# EasyEDA Pro project debug_jig.eprj

# Schematic Schematic1
Board Name: Board1; Create Date: 2026-01-15; Page Name: P1; Project Name: debug_jig; Schematic Name: Schematic1; Update Date: 2026-01-31; Company: EasyEDA.com; Page Size: A4; Version: V1.0
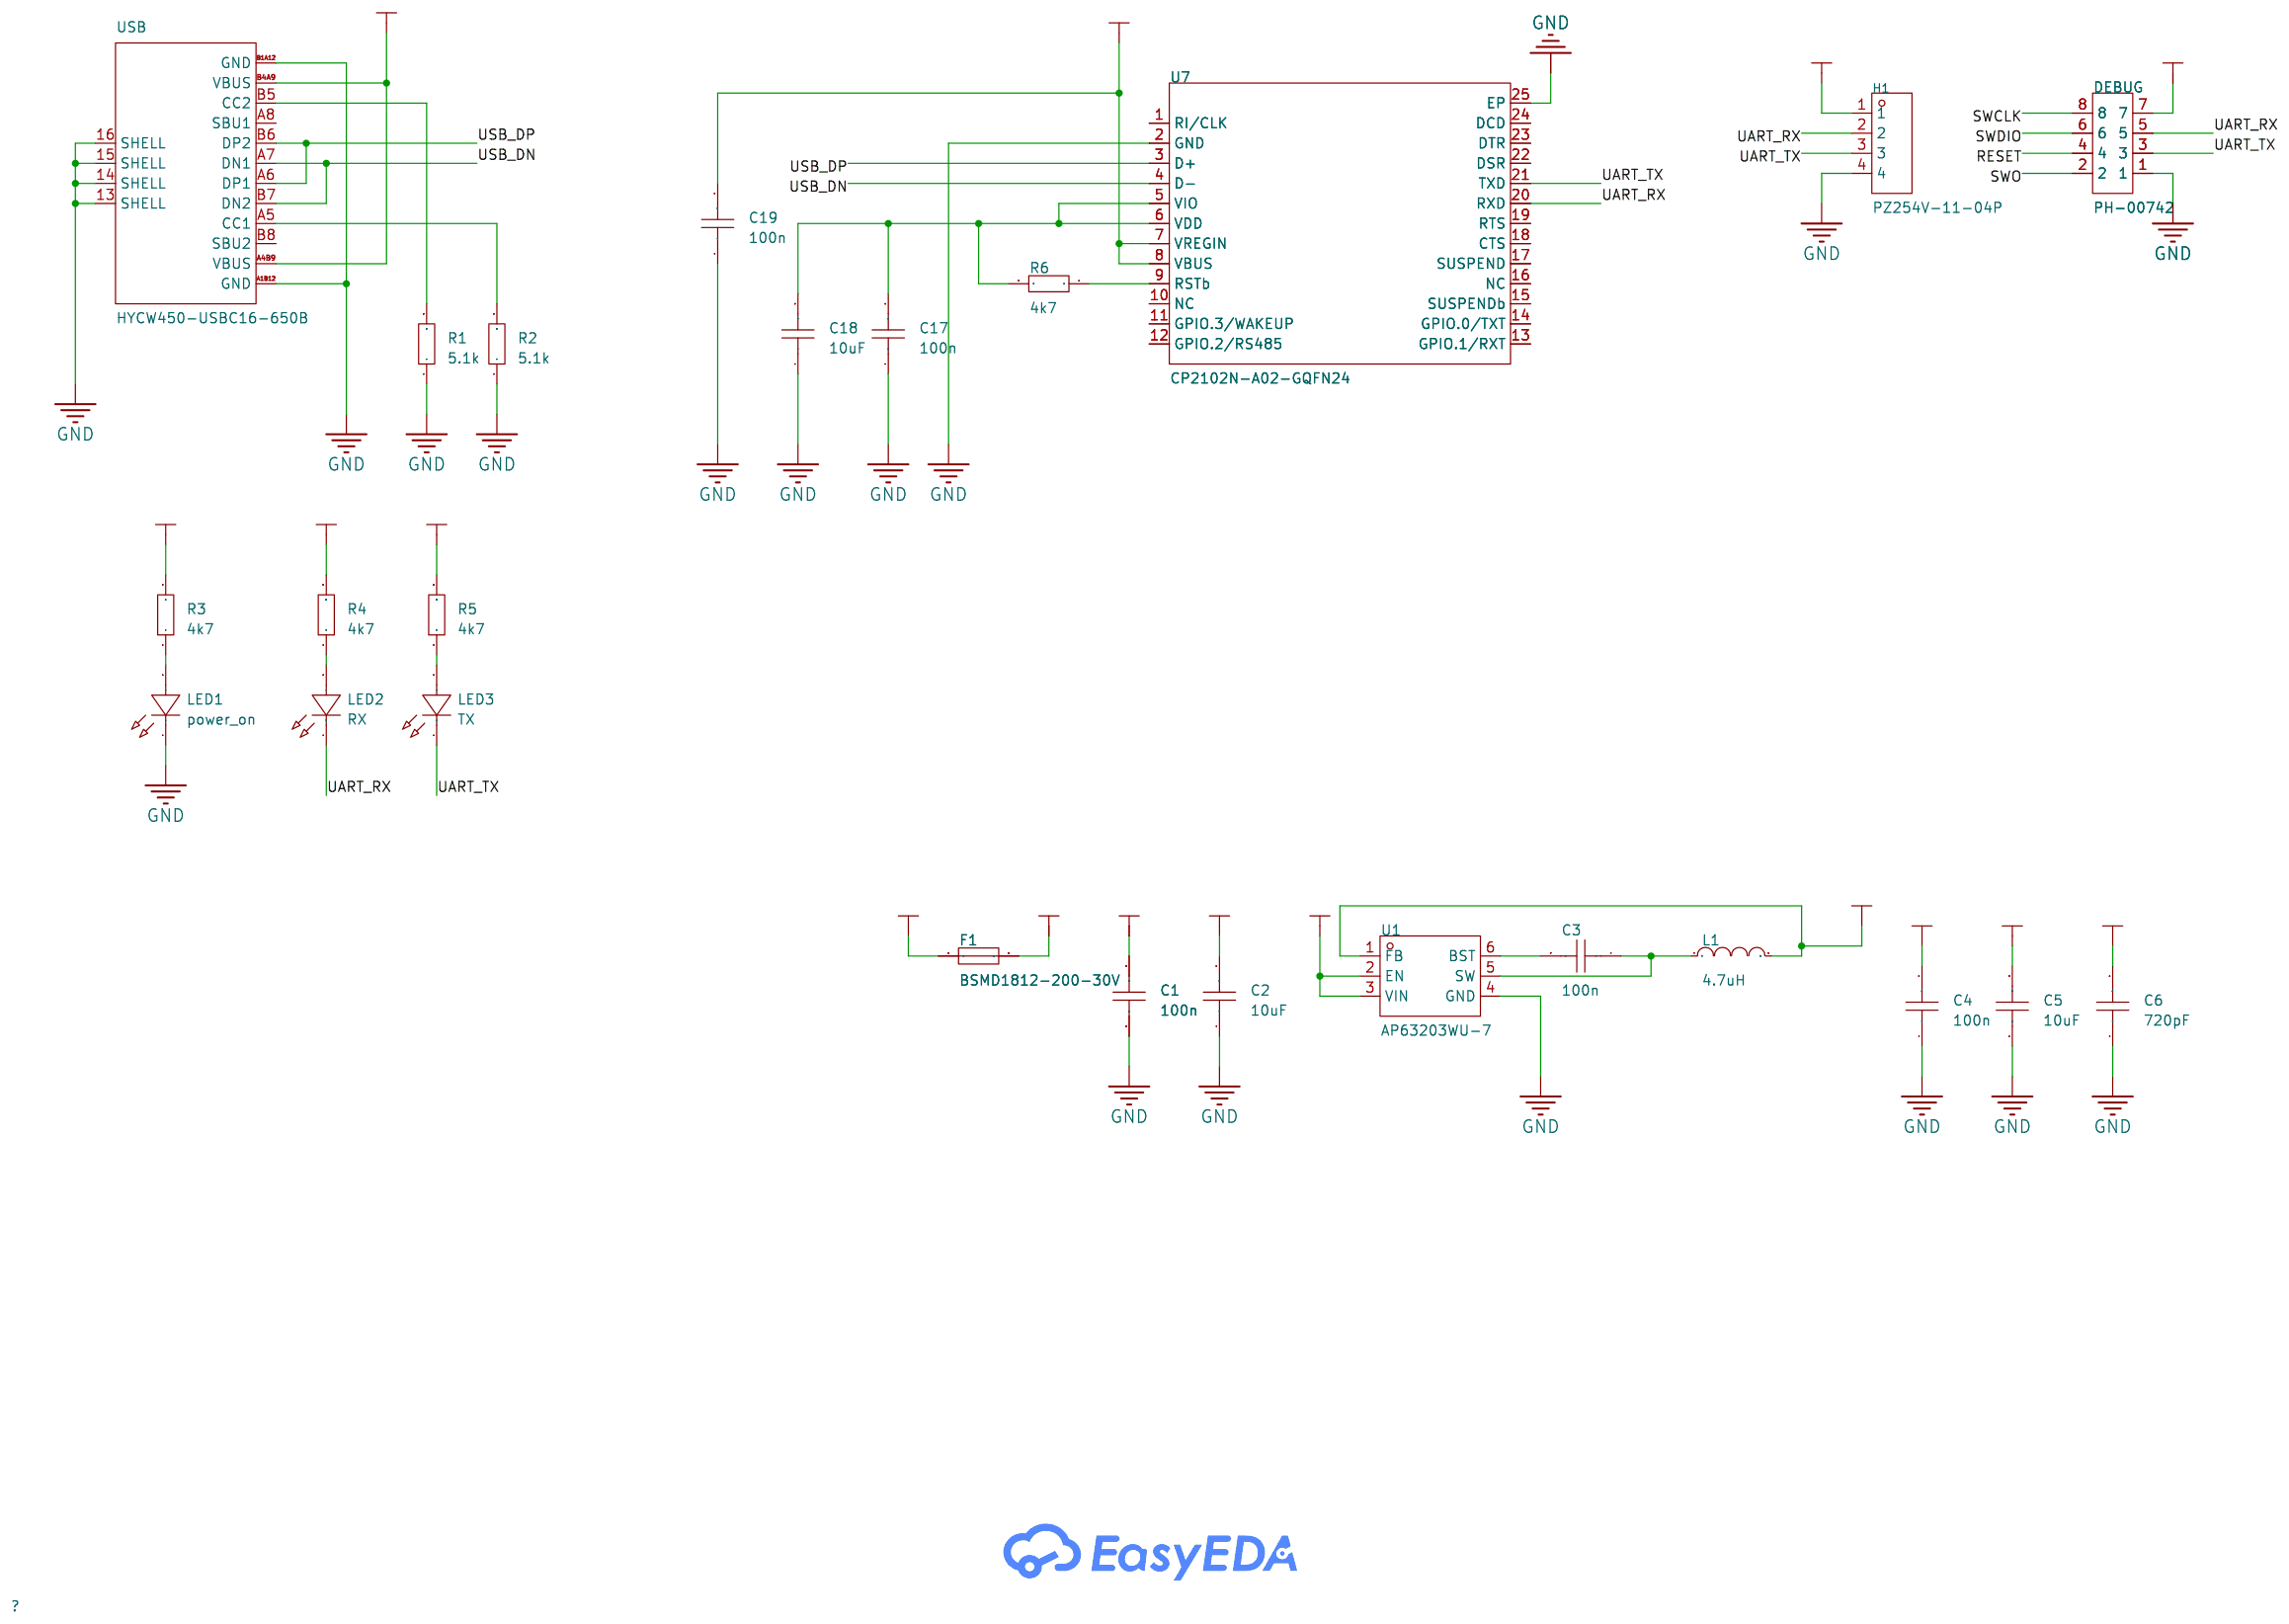
[diagram p0: schematic sheet]

## Parts
C1  100n  [C0805]
C2  100n  [C0805]
C3  100n  [C0805]
C4  100n  [C0805]
C5  100n  [C0805]
C6  100n  [C0805]
C17  100n  [C0805]
C18  100n  [C0805]
C19  100n  [C0805]
DEBUG  PH-00742  [HDR-TH_8P-P1.27-V-M-R2-C4-S1.27]
F1  BSMD1812-200-30V  [F1812]
H1  PZ254V-11-04P  [HDR-TH_4P-P2.54-V-M]
L1  4.7uH  [IND-SMD_L4.0-W4.0_FNR40XXS]
LED1  power_on  [LED1206-RD]
LED2  RX  [LED1206-RD]
LED3  TX  [LED1206-RD]
R1  330  [R0805]
R2  330  [R0805]
R3  4k7  [R0805]
R4  4k7  [R0805]
R5  4k7  [R0805]
R6  4k7  [R0805]
U1  AP63203WU-7  [TSOT-26_L2.9-W1.6-P0.95-LS2.8-BL]
U7  CP2102N-A02-GQFN24  [QFN-24_L4.0-W4.0-P0.50-TL-EP2.5]
USB  HYCW450-USBC16-650B  [USB-C-SMD_HYCW450-USBC16-650B]

## Library data of the parts
C1-C6 C17-C19 = CL21A106KAYNNNE_C15850: Capacitance:10uF Tolerance:±10% Tolerance:±10% Voltage Rating:25V Temperature Coefficient:X5R; LCSC Part Name: 10uF ±10% 25V; Supplier Part: C15850; Manufacturer: SAMSUNG(三星); Manufacturer Part: CL21A106KAYNNNE; Supplier Footprint: 0805; JLCPCB Part Class: Basic Part; Datasheet: https://item.szlcsc.com/datasheet/CL21A106KAYNNNE/16532.html; Supplier: LCSC; Tolerance: ±10%; Voltage Rating: 25V; Temperature Coefficient: X5R
DEBUG = PH-00742: Pin Structure:2x4P Pitch:1.27mm Row Spacing:1.27mm Circluar Pins/Square Pins:Pin Header Mounting Type:Through Hole Number of Rows:2 Number of Pins:8P Current Rating:1A Voltage Rating (Max):- Length of Mating Pin:3mm Insulation Height:2mm Length of End Con; LCSC Part Name: 2x4P 间距:1.27mm 方针 直插; Supplier Part: C2685182; Manufacturer: Liansheng(连盛); Supplier Footprint: 插件,P=1.27mm; JLCPCB Part Class: Extended Part; Datasheet: https://item.szlcsc.com/datasheet/PH-00742/2784456.html; Supplier: LCSC; Pin Structure: 2x4P; Pitch: 1.27mm; Row Spacing: 1.27mm; Circluar Pins/Square Pins: Pin Header; Mounting Type: Through Hole; Number of Rows: 2; Number of Pins: 8P; Current Rating: 1A; Length of Mating Pin: 3mm; Insulation Height: 2mm; Length of End Connection Pin: 2mm; Operating Temperature: -40℃~+105℃; Color: Black
F1 = BSMD1812-200-30V: Voltage - Max:30V Current - Max:40A Hold Current:2A Trip Current:4A Power Dissipation:1W Resistance - Initial (Ri) (Min):20mΩ Resistance - Post Trip (R1) (Max):100mΩ Time to Trip(Max):- Operating Temperature:-40℃~+85℃ Operating Temperature:-40℃~+85℃ Lengt; LCSC Part Name: 30V 2A 1812自恢复; Supplier Part: C960026; Manufacturer: BHFUSE(佰宏); Supplier Footprint: 1812; JLCPCB Part Class: Extended Part; Datasheet: https://item.szlcsc.com/datasheet/BSMD1812-200-30V/1039126.html; Supplier: LCSC; Voltage - Max: 30V; Current - Max: 40A; Hold Current: 2A; Trip Current: 4A; Power Dissipation: 1W; Resistance - Initial (Ri) (Min): 20mΩ; Resistance - Post Trip (R1) (Max): 100mΩ; Operating Temperature: -40℃~+85℃; Length: 4.73mm; Width: 3.41mm; Height: 1.5mm
H1 = PZ254V-11-04P: LCSC Part Name: 1x4P 间距:2.54mm 方针 直插; Supplier Part: C2691448; Manufacturer: XFCN(兴飞); Supplier Footprint: 插件,P=2.54mm; JLCPCB Part Class: Extended Part; Datasheet: https://item.szlcsc.com/datasheet/PZ254V-11-04P/2801085.html; Supplier: LCSC; Pin Structure: 1x4P; Pitch: 2.54mm; Circluar Pins/Square Pins: Pin Header; Mounting Type: Through Hole; Number of Rows: 1; Number of Pins: 4P; Current Rating: 3A; Voltage Rating (Max): 250V; Length of Mating Pin: 6mm; Insulation Height: 2.5mm; Length of End Connection Pin: 3mm; Operating Temperature: -40℃~+105℃; Color: Black
L1 = FNR4030S4R7MT: Inductance:4.7uH Tolerance:±20% Tolerance:±20% Current Rating:2.3A Current - Saturation(Isat):3.2A DC Resistance(DCR):78mΩ Type:Magnetic Core Shielded Winding Alloy Inductor; LCSC Part Name: 4.7uH ±20% 3.2A; Supplier Part: C167874; Manufacturer: cjiang(长江微电); Supplier Footprint: SMD,4x4mm; JLCPCB Part Class: Extended Part; Datasheet: https://atta.szlcsc.com/upload/public/pdf/source/20190327/C167925_9EFF0AABC4CA629C2CC95961DBF7D39D.pdf; Supplier: LCSC; Tolerance: ±20%; Current Rating: 2.3A; Current - Saturation(Isat): 3.2A; DC Resistance(DCR): 78mΩ; Type: Magnetic Core Shielded Winding Alloy Inductor
LED1-LED3 = YLED1206G: Lamp Holder Type:- Illumination Color:Emerald Green Voltage - Forward(Vf):2.4V~3.1V Voltage - Forward(Vf):2.4V~3.1V Power(Watts):100mW Forward Current:20mA Wavelength - Dominant:516nm~531nm Wavelength - Dominant:516nm~531nm Peak Wavelength:525nm Diode Con; LCSC Part Name: 发光管; Supplier Part: C30584801; Manufacturer: YONGYUTAI(永裕泰); Supplier Footprint: 1206; JLCPCB Part Class: Extended Part; Datasheet: https://item.szlcsc.com/datasheet/YLED1206G/32319013.html; Supplier: LCSC; Illumination Color: Emerald Green; Voltage - Forward(Vf): 2.4V~3.1V; Power(Watts): 100mW; Forward Current: 20mA; Wavelength - Dominant: 516nm~531nm; Peak Wavelength: 525nm; Luminous Intensity: 620mcd; Viewing Angle: 120°; Operating Temperature: -40℃~+85℃
R1-R6 = 0805W8F1002T5E: Type:Thick Film Resistor Resistance:10kΩ Tolerance:±1% Tolerance:±1% Power(Watts):125mW Voltage-Supply(Max):150V Temperature Coefficient:±100ppm/℃ Temperature Coefficient:±100ppm/℃ Operating Temperature:-55℃~+155℃ Operating Temperature:-55℃~+155℃; LCSC Part Name: 10kΩ ±1% 125mW 厚膜电阻; Supplier Part: C17414; Manufacturer: UNI-ROYAL(厚声); Supplier Footprint: 0805; JLCPCB Part Class: Basic Part; Datasheet: https://item.szlcsc.com/datasheet/0805W8F1002T5E/18102.html; Supplier: LCSC; Type: Thick Film Resistor; Tolerance: ±1%; Power(Watts): 125mW; Voltage-Supply(Max): 150V; Temperature Coefficient: ±100ppm/℃; Operating Temperature: -55℃~+155℃
U1 = AP63203WU-7: Function:Buck Voltage - Supply:3.8V~32V Voltage - Supply:3.8V~32V Output Voltage:3.3V Output Voltage:3.3V Output Current:2A Frequency - Switching:1.1MHz Frequency - Switching:1.1MHz Operating Temperature:-40℃~+85℃@(TA) Operating Temperature:-40℃~+85℃@(TA); LCSC Part Name: 3.8V至32V输入、2A低静态电流同步降压转换器，增强EMI抑制; Supplier Part: C780769; Manufacturer: DIODES(美台); Supplier Footprint: TSOT-23-6; JLCPCB Part Class: Extended Part; Datasheet: https://item.szlcsc.com/datasheet/AP63203WU-7/832852.html; Supplier: LCSC; Function: Buck; Voltage - Supply: 3.8V~32V; Output Voltage: 3.3V; Output Current: 2A; Frequency - Switching: 1.1MHz; Operating Temperature: -40℃~+85℃@(TA); Synchronous Rectifier: Yes; Number of Outputs: 1; Topology: Buck; Quiescent Current: 22uA; Switch tube (built-in/external): Built-In; Output Type: Fixed
U7 = CP2102N-A02-GQFN24: Supplier Part: C1550551; Manufacturer: SKYWORKS/SILICON LABS(芯科); Supplier Footprint: QFN-24-EP(4x4); JLCPCB Part Class: Extended Part; Datasheet: https://atta.szlcsc.com/upload/public/pdf/source/20201204/C964632_F2B790CC23A72455AEF523510305B30A.pdf; Supplier: LCSC; Applications Function: USB to UART; Voltage - Supply: 3V~3.6V; Operating Temperature: -40℃~+85℃@(Ta)
USB = HYCW450-USBC16-650B: Connector Type:Type-C Protocol Standard:- Gender:Female Mounting Type:Surface Mount, Right Angle Number of Contacts:16P Number of Ports:1 Current Rating-Power:5A Voltage Rating:- Connect-Disconnect Life:10,000 Cycles Length:6.5mm Detection color:Black Ope; LCSC Part Name: Type-C 母 卧贴; Supplier Part: C42400253; Manufacturer: 华宇创; Supplier Footprint: SMD; Datasheet: https://item.szlcsc.com/datasheet/HYCW450-USBC16-650B/44352786.html; Supplier: LCSC; Connector Type: Type-C; Gender: Female; Mounting Type: Surface Mount, Right Angle; Number of Contacts: 16P; Number of Ports: 1; Current Rating-Power: 5A; Connect-Disconnect Life: 10,000 Cycles; Length: 6.5mm; Detection color: Black; Operating Temperature: -25℃~+85℃

## Nets
3V3: C4.2 C5.2 C6.2 DEBUG.7 H1.1 L1.2 R3.2 R4.2 R5.2 U1.1(FB)
5V: C1.2 C2.2 C19.2 F1.2 U1.2(EN) U1.3(VIN) U7.7(VREGIN) U7.8(VBUS)
GND: C1.1 C2.1 C4.1 C5.1 C6.1 C17.1 C18.1 C19.1 DEBUG.1 H1.4 LED1.1(K) R1.1 R2.1 U1.4(GND) U7.2(GND) U7.25(EP) USB.13(SHELL) USB.14(SHELL) USB.15(SHELL) USB.16(SHELL) USB.A1B12(GND) USB.B1A12(GND)
VDD: F1.1 USB.A4B9(VBUS) USB.B4A9(VBUS)
RESET: DEBUG.4
SWCLK: DEBUG.8
SWDIO: DEBUG.6
SWO: DEBUG.2
UART_RX: DEBUG.5 H1.2 LED2.1(K) U7.20(RXD)
UART_TX: DEBUG.3 H1.3 LED3.1(K) U7.21(TXD)
USB_DN: U7.4(D-) USB.A7(DN1) USB.B7(DN2)
USB_DP: U7.3(D+) USB.A6(DP1) USB.B6(DP2)
$1N4420: R1.2 USB.B5(CC2)
$1N4421: R2.2 USB.A5(CC1)
$1N4426: LED1.2(A) R3.1
$1N4451: C3.2 U1.6(BST)
$1N4452: C3.1 L1.1 U1.5(SW)
$1N4475: LED2.2(A) R4.1
$1N4479: LED3.2(A) R5.1
$1N6957: C17.2 C18.2 R6.2 U7.5(VIO) U7.6(VDD)
$1N7341: R6.1 U7.9(RSTb)

Not connected (* = marked no-connect by the designer): U7 1(RI/CLK) 10(NC) 11(GPIO.3/WAKEUP) 12(GPIO.2/RS485) 13(GPIO.1/RXT) 14(GPIO.0/TXT) 15(SUSPENDb) 16(NC) 17(SUSPEND) 18(CTS) 19(RTS) 22(DSR) 23(DTR) 24(DCD); USB A8(SBU1) B8(SBU2)

# Board PCB1
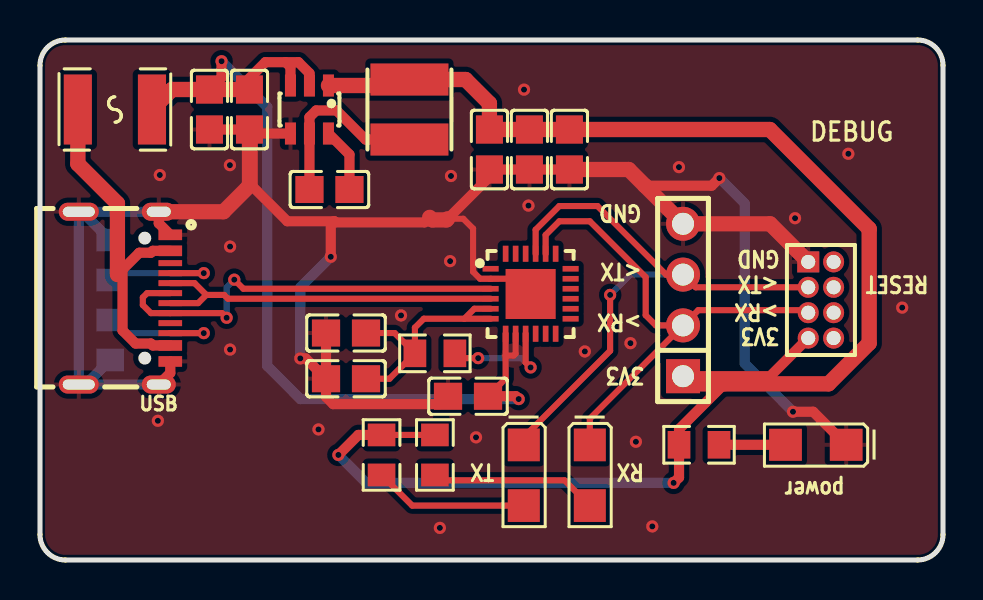
[diagram p1: board, top side]
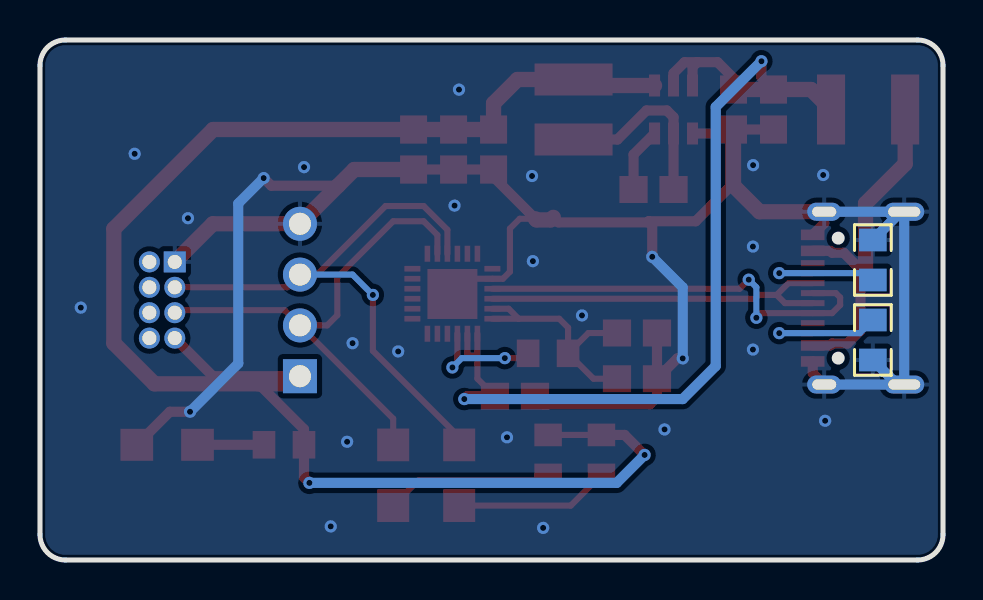
[diagram p2: board, bottom side, seen from below]

Outline 45.16 x 26 mm; copper layers: Top Layer, Bottom Layer. Coordinates in mm from the lower left corner of the outline.
Outline path: 0,24.73 0,1.27 arc(0.37,0.37) 1.27,0 43.89,0 arc(44.79,0.37) 45.16,1.27 45.16,24.73 arc(44.79,25.63) 43.89,26 1.27,26 arc(0.37,25.63) 0,24.73
Stack: Top Layer 0.035mm / Dielectric1 1.51mm FR4 er 4.5 / Bottom Layer 0.035mm

## Design rules (mm)
template: JLCPCB Capability(Two Layers Board)
spacing copperThickness1oz (default): track to track 0.102, other pairs 0.152 to 0.3
spacing copperThickness2oz: track to track 0.203, other pairs 0.152 to 0.3
track width copperThickness1oz (default): min 0.127, default 0.254, max 2.54
track width copperThickness2oz: min 0.203, default 0.254, max 2.54
differential pair differentialPair (default): width min 0.127, default 0.254, max 2.54; gap min 0.152, default 0.152
via viaSize (default): diameter min 0.5, default 0.61, max 10; hole min 0.3, default 0.305, max 6.3

## Placement (name value [footprint] x y rotation side)
C1  100n  [C0805]  10.48 22.52 90 top
C2  100n  [C0805]  8.48 22.52 90 top
C3  100n  [C0805]  14.48 18.52 0 top
C4  100n  [C0805]  22.48 20.52 90 top
C5  100n  [C0805]  24.48 20.52 90 top
C6  100n  [C0805]  26.48 20.52 90 top
C17  100n  [C0805]  15.3 11.35 0 top
C18  100n  [C0805]  15.3 9.06 0 top
C19  100n  [C0805]  21.4 8.19 0 top
DEBUG  PH-00742  [HDR-TH_8P-P1.27-V-M-R2-C4-S1.27]  39.05 13 270 top
F1  BSMD1812-200-30V  [F1812]  3.75 22.53 0 top
H1  PZ254V-11-04P  [HDR-TH_4P-P2.54-V-M]  32.16 13 90 top
L1  4.7uH  [IND-SMD_L4.0-W4.0_FNR40XXS]  18.48 22.52 90 top
LED1  power_on  [LED1206-RD]  38.8 5.76 180 top
LED2  RX  [LED1206-RD]  27.5 4.24 270 top
LED3  TX  [LED1206-RD]  24.19 4.24 270 top
R1  330  [R0805]  3.51 11 90 bottom
R2  330  [R0805]  3.51 15 270 bottom
R3  4k7  [R0805]  32.96 5.76 180 top
R4  4k7  [R0805]  19.75 5.25 90 top
R5  4k7  [R0805]  17.08 5.25 90 top
R6  4k7  [R0805]  19.75 10.33 180 top
U1  AP63203WU-7  [TSOT-26_L2.9-W1.6-P0.95-LS2.8-BL]  13.48 22.52 180 top
U7  CP2102N-A02-GQFN24  [QFN-24_L4.0-W4.0-P0.50-TL-EP2.5]  24.53 13.31 0 top
USB  HYCW450-USBC16-650B  [USB-C-SMD_HYCW450-USBC16-650B]  4.23 13.09 270 top

## Footprints (pads in the part's own frame, mm; a bottom-side part is the same pattern mirrored in y, then rotated)
C0805
  rect 1.41x1.35 smd: 1(-1,0) 2(1,0)
F1812
  rect 1.407x3.499 smd: 1(-1.853,0) 2(1.853,0)
HDR-TH_4P-P2.54-V-M
  rect 1.7x1.7 hole 1.1: 1(-3.81,0)
  round 1.7 hole 1.1: 2(-1.27,0) 3(1.27,0) 4(3.81,0)
HDR-TH_8P-P1.27-V-M-R2-C4-S1.27
  rect 1.05x1.1 hole 0.7: 1(-1.905,-0.635)
  round 1.05 hole 0.7: 2(-1.905,0.635) 3(-0.635,-0.635) 4(-0.635,0.635) 5(0.635,-0.635) 6(0.635,0.635) 7(1.905,-0.635) 8(1.905,0.635)
IND-SMD_L4.0-W4.0_FNR40XXS
  rect 1.6x3.9 smd: 1(-1.5,0) 2(1.5,0)
LED1206-RD
  rect 1.635x1.6 smd: 1(-1.518,0) 2(1.518,0)
QFN-24_L4.0-W4.0-P0.50-TL-EP2.5
  rect 0.8x0.28 smd: 1(-2,1.25) 2(-2,0.75) 3(-2,0.25) 4(-2,-0.25) 5(-2,-0.75) 6(-2,-1.25) 13(2,-1.25) 14(2,-0.75) 15(2,-0.25) 16(2,0.25) 17(2,0.75) 18(2,1.25)
  rect 0.28x0.8 smd: 7(-1.25,-2) 8(-0.75,-2) 9(-0.25,-2) 10(0.25,-2) 11(0.75,-2) 12(1.25,-2) 19(1.25,2) 20(0.75,2) 21(0.25,2) 22(-0.25,2) 23(-0.75,2) 24(-1.25,2)
  rect 2.5x2.5 smd: 25(-0.001,-0.013)
R0805
  rect 1.133x1.377 smd: 1(-1,0) 2(1,0)
TSOT-26_L2.9-W1.6-P0.95-LS2.8-BL
  rect 0.55x1.1 smd: 1(-0.95,-1.2) 2(0,-1.2) 3(0.95,-1.2) 4(0.95,1.2) 5(0,1.2) 6(-0.95,1.2)
USB-C-SMD_HYCW450-USBC16-650B
  oval 0.9x2 hole 0.5x1.6: 13(-4.32,-2.288) 14(4.32,-2.288)
  oval 0.9x1.7 hole 0.5x1.2: 15(-4.32,1.712) 16(4.32,1.712)
  rect 0.53x1.18 smd: A1B12(-3.165,2.288) A4B9(-2.365,2.288) B1A12(3.165,2.288) B4A9(2.365,2.288)
  rect 0.3x1.18 smd: A5(-1.25,2.288) A6(-0.25,2.288) A7(0.25,2.288) A8(1.25,2.288) B5(1.75,2.288) B6(0.75,2.288) B7(-0.75,2.288) B8(-1.75,2.288)

## Nets
As in the schematic.

Pads without a net: U7 1 10 11 12 13 14 15 16 17 18 19 22 23 24; USB A8 B8

## Via types
v1: diameter 0.61, hole 0.305, Top Layer to Bottom Layer, 36 vias

## Routing (per net, layer and track width the routed paths; a pad name or vN(x,y) marks a point on that pad's centre or on a via; arc(x,y) is an arc through that point)
3V3: length 82
  Top Layer w0.305: R5.2 R4.2
  Top Layer w0.508: H1.1 36.51,9.19 DEBUG.7 ; v1(14.92,5.25) 15.92,6.25 R5.2 ; 34.23,8.81 31.96,6.54 R3.2 31.96,4.13 v1(31.69,3.86)
  Top Layer w0.762: L1.2 21.28,24.02 22.48,22.83 C4.2 C5.2 C6.2 36.5,21.52 41.47,16.56 41.47,10.84 39.43,8.81 32.54,8.81 H1.1 ; U1.1 17.65,23.72 17.84,23.92
  Bottom Layer w0.508: v1(31.69,3.86) 16.32,3.86 v1(14.92,5.25)
5V: length 48.7
  Top Layer w0.305: C19.2 23.28,9.07 23.28,10.22 ; 23.28,10.22 23.69,10.22 23.78,10.31 U7.8 ; 23.28,10.22 U7.7
  Top Layer w0.508: 12.29,24.89 11.27,24.89 10.48,24.09 ; 12.29,24.89 12.53,24.65 U1.3 ; 12.29,24.89 12.92,24.89 13.48,24.34 U1.2 ; v1(23.94,8.05) 23.8,8.19 C19.2 ; v1(9.08,24.94) 9.08,24.13 C2.2
  Top Layer w0.762: F1.2 6.6,23.52 C2.2 C1.2 10.71,23.52 10.73,23.54
  Bottom Layer w0.508: v1(9.08,24.94) 11.37,22.65 11.37,9.7 13.02,8.05 v1(23.94,8.05)
GND: length 115.8
  Top Layer w0.305: U7.25 23.77,14.06 U7.2 22.01,14.06 21.66,14.41 21.66,16.57 21.17,17.06 20.39,17.06
  Top Layer w0.508: LED1.1 38.66,7.41 v1(37.66,7.41) ; U1.4 10.68,21.32 10.64,21.36 10.64,18.67 12.37,16.94 14.71,16.94 ; USB.A1B12 5.94,16.83 USB.15 ; C2.1 C1.1 ; 19.49,17.13 19.23,16.88 14.77,16.88 14.71,16.94 ; v1(33.97,19.1) 33.59,18.72 30.25,18.72 ; USB.B1A12 6.52,9.35 USB.16 ; C18.1 C17.1 ; C18.1 13.29,10.08 v1(13.02,10.08) ; C18.1 14.3,8.15 14.66,7.79 20.01,7.79 C19.1 ; 14.71,16.94 14.54,16.76 v1(14.54,15.16) ; C6.1 C5.1 C4.1 22.48,19.15 20.39,17.06
  Top Layer w0.762: USB.15 9.18,17.41 10.48,18.71 C1.1 ; DEBUG.1 36.51,16.81 H1.4 29.44,19.52 C6.1 ; 19.49,17.13 19.61,17.01 20.33,17.01 20.39,17.06
  Bottom Layer w0.508: USB.16 2.28,8.77 ; 2.28,8.77 R1.1 ; 2.28,8.77 USB.14 1.94,17.41 ; v1(33.97,19.1) 35.24,17.83 35.24,9.83 v1(37.66,7.41) ; v1(14.54,15.16) 13.02,13.64 v1(13.02,10.08) ; R2.1 2.09,17.41 ; 2.09,17.41 USB.13 ; 2.09,17.41 USB.15
  vias: v1(5.89,6.96) v1(5.99,19.25) v1(9.5,19.74) v1(9.51,15.67) v1(9.51,10.52) v1(13.93,6.53) v1(18.05,12.23) v1(20,1.61) v1(20.55,19.2) v1(20.51,14.94) v1(21.8,6.13) v1(24.2,23.52) v1(24.43,17.72) v1(27.25,10.43) v1(29.53,10.84) v1(29.8,5.91) v1(30.62,1.68) v1(31.95,19.64) v1(37.76,17.09) v1(40.42,20.31) v1(43.12,12.62)
VDD: length 17.6
  Top Layer w0.508: USB.A4B9 5.64,15.46 5.54,15.36 4.97,15.36 4.1,14.5 4.13,14.47 4.13,11.48 4.78,10.82 5.54,10.82 5.64,10.73 USB.B4A9
  Top Layer w0.762: 3.87,14.27 3.87,17.83 1.89,19.81 F1.1
UART_RX: length 25.9
  Top Layer w0.305: U7.20 25.28,16.25 25.97,16.94 27.5,16.94 30.29,14.14 30.29,12.24 30.8,11.73 H1.2 ; DEBUG.5 38.29,12.49 32.92,12.49 H1.2 ; H1.2 27.5,7.07 LED2.1
UART_TX: length 30.4
  Top Layer w0.305: v1(28.51,13.25) 28.51,10.46 24.19,6.14 LED3.1 ; DEBUG.3 32.79,13.64 H1.3 31.31,14.27 27.88,17.7 25.97,17.7 24.78,16.51 U7.21
  Bottom Layer w0.305: v1(28.51,13.25) 29.53,14.27 H1.3
USB_DN: length 18.3
  Top Layer w0.305: USB.B7 7.73,13.84 8.32,13.25 ; 8.32,13.25 7.91,12.84 USB.A7 ; 8.32,13.25 9.21,13.25 9.4,13.06 U7.4
USB_DP: length 21.4
  Top Layer w0.305: U7.3 10.17,13.56 v1(9.72,14.02) ; USB.A6 5.36,13.34 5.14,13.13 5.14,12.75 5.55,12.34 USB.B6 9.1,12.34 v1(9.33,12.11)
  Bottom Layer w0.305: v1(9.72,14.02) 9.33,13.64 v1(9.33,12.11)
$1N4420: length 6.6
  Top Layer w0.305: USB.B5 v1(8.19,11.34)
  Bottom Layer w0.305: R1.2 4.17,11.34 v1(8.19,11.34)
$1N4421: length 6.5
  Top Layer w0.305: USB.A5 v1(8.19,14.34)
  Bottom Layer w0.305: R2.2 3.85,14.34 v1(8.19,14.34)
$1N4426: length 3.3
  Top Layer w0.508: R3.1 LED1.2
$1N4451: length 3.2
  Top Layer w0.508: U1.6 15.48,20.27 C3.2
$1N4452: length 9.4
  Top Layer w0.508: C3.1 U1.5 13.48,22.14 13.81,22.48 14.83,22.48 16.28,21.02 L1.1
$1N4475: length 8.4
  Top Layer w0.305: LED2.2 26.23,3.98 20.02,3.98 R4.1
$1N4479: length 7.7
  Top Layer w0.305: LED3.2 18.61,2.72 R5.1
$1N6957: length 12.6
  Top Layer w0.305: R6.2 17.73,11.35 C17.2 ; R6.2 17.48,9.06 C18.2 ; R6.2 18.75,11.62 19.19,12.06 21.22,12.06 ; 21.22,12.06 21.72,12.56 U7.5 ; 21.22,12.06 U7.6
$1N7341: length 5.9
  Top Layer w0.305: R6.1 20.99,10.09 v1(21.91,10.09) ; U7.9 24.28,9.88 v1(24.53,9.63)
  Bottom Layer w0.305: v1(24.53,9.63) 24.07,10.09 v1(21.91,10.09)

## Copper pours and planes (outline as drawn; the poured copper is in the pictures)
GND on Top Layer: -2.86,27.73 47.05,27.73 47.05,-2.88 -2.86,-2.88
GND on Bottom Layer: -2.73,29.89 46.55,29.89 46.55,-0.97 -2.73,-0.97

## Text on the board
Top Silkscreen Layer: power | TX | GND | <TX | >RX | 3V3 | RX | RESET
